# Altium schematic sheet Battery_and_Bypass_Controller_Connectons.SchDoc: Battery and Bypass Controller Connectons
size 292 x 193 mm; SheetNumber: 8; SheetTotal: 11; SPICEModelCacheMGYABEQD: <root> / <DocumentId>MGYABEQD</DocumentId> / </root>; SheetSize: A4
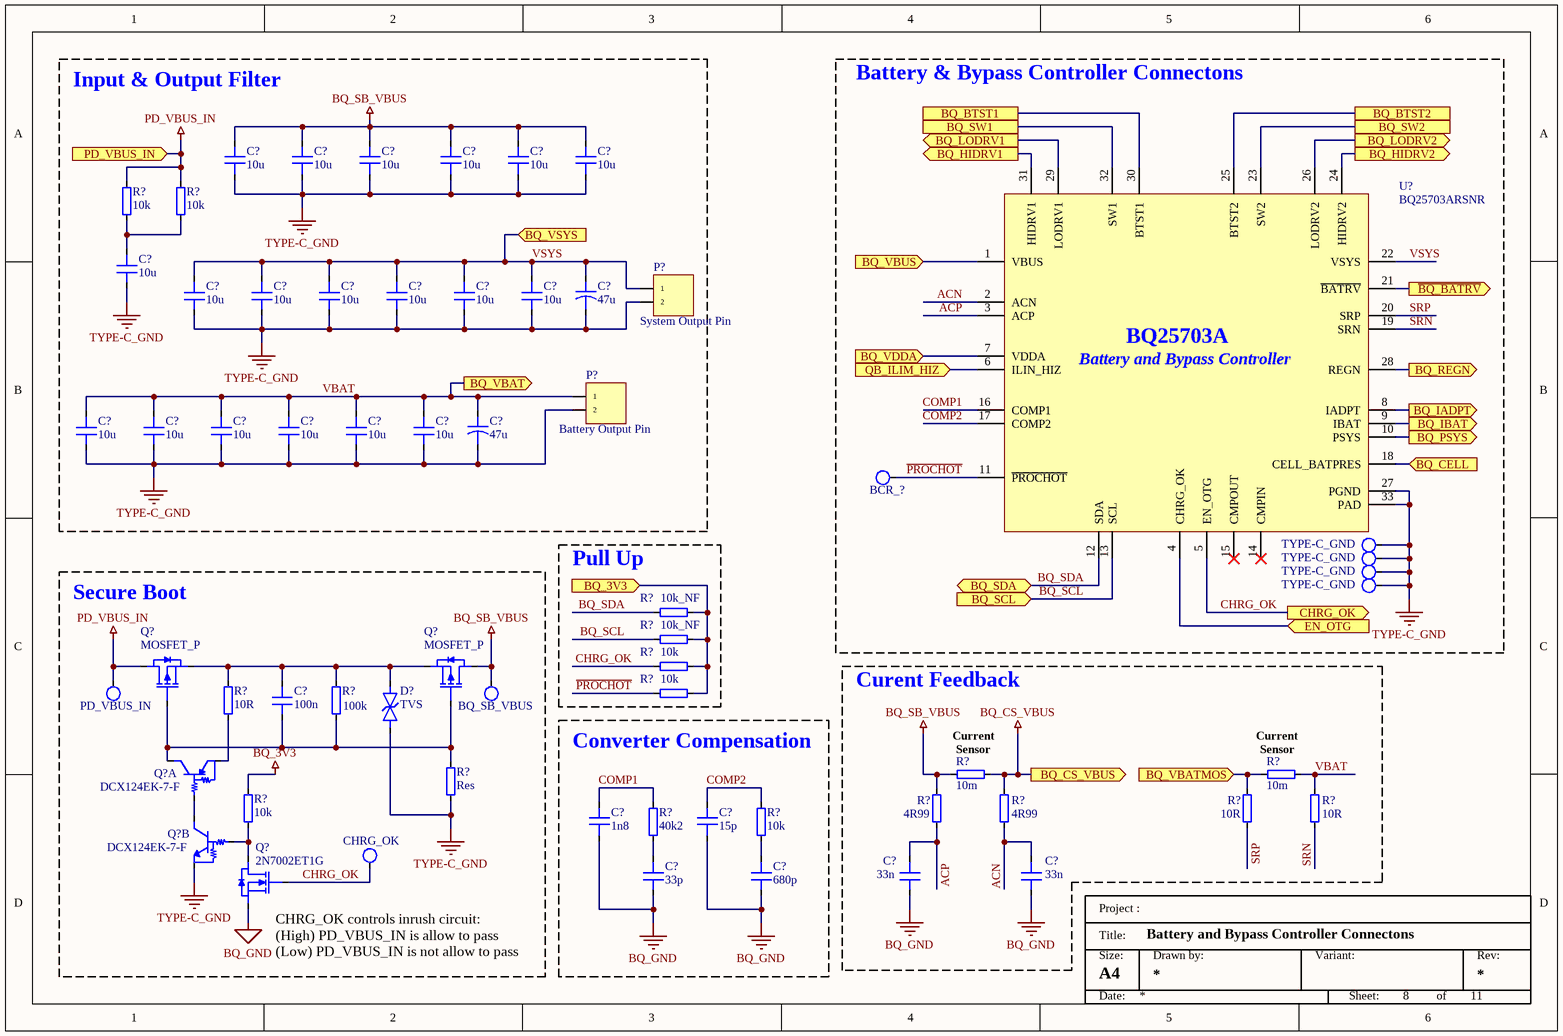
[diagram p0: Battery_and_Bypass_Controller_Connectons.SchDoc]

## Parts
(Parts that share a designator on the sheet are numbered #1, #2 ... from top to bottom, then left to right.)
BCR_?  SMD_25mil  [TestPoint_smd_25mil]  (value not drawn)
BQ_SB_VBUS  SMD_25mil  [TestPoint_smd_25mil]  (value not drawn)
C?#1  10u  [0805_Cap]
C?#2  10u  [0805_Cap]
C?#3  10u  [0805_Cap]
C?#4  10u  [0805_Cap]
C?#5  10u  [0805_Cap]
C?#6  10u  [0805_Cap]
C?#7  47u
C?#8  10u  [0805_Cap]
C?#9  10u  [0805_Cap]
C?#10  10u  [0805_Cap]
C?#11  10u  [0805_Cap]
C?#12  10u  [0805_Cap]
C?#13  10u  [0805_Cap]
C?#14  10u  [0805_Cap]
C?#15  47u
C?#16  10u  [0805_Cap]
C?#17  10u  [0805_Cap]
C?#18  10u  [0805_Cap]
C?#19  10u  [0805_Cap]
C?#20  10u  [0805_Cap]
C?#21  10u  [0805_Cap]
C?#22  100n  [0805_Cap]
C?#23  1n8  [0805_Cap]
C?#24  15p  [0805_Cap]
C?#25  33p  [0805_Cap]
C?#26  680p  [0805_Cap]
C?#27  33n  [0805_Cap]
C?#28  33n  [0805_Cap]
CHRG_OK  SMD_25mil  [TestPoint_smd_25mil]  (value not drawn)
D?  TVS  [SOD-523]
P?#1  System Output Pin  [XT60PW-M]
P?#2  Battery Output Pin  [XT60PW-M]
PD_VBUS_IN  SMD_25mil  [TestPoint_smd_25mil]  (value not drawn)
Q?#1  MOSFET_P  [SOT-523-3]
Q?#2  MOSFET_P  [SOT-523-3]
Q?#3  DCX124EK-7-F  [SOT-26]  (part A of 2)
Q?#4  2N7002ET1G  [SOT-523-3]
Q?#5  DCX124EK-7-F  [SOT-26]  (part B of 2)
R?#1  10k  [0603_Res]
R?#2  10k  [0603_Res]
R?#3  10k_NF  [0603_Res]
R?#4  10k_NF  [0603_Res]
R?#5  10k  [0603_Res]
R?#6  10R  [0603_Res]
R?#7  100k  [0603_Res]
R?#8  10k  [0603_Res]
R?#9  Res  [0603_Res]
R?#10  10m  [0603_Res]
R?#11  10m  [0603_Res]
R?#12  10k  [0603_Res]
R?#13  4R99  [0603_Res]
R?#14  4R99  [0603_Res]
R?#15  10R  [0603_Res]
R?#16  10R  [0603_Res]
R?#17  40k2  [0603_Res]
R?#18  10k  [0603_Res]
TYPE-C_GND#1  SMD_25mil  [TestPoint_smd_25mil]  (value not drawn)
TYPE-C_GND#2  SMD_25mil  [TestPoint_smd_25mil]  (value not drawn)
TYPE-C_GND#3  SMD_25mil  [TestPoint_smd_25mil]  (value not drawn)
TYPE-C_GND#4  SMD_25mil  [TestPoint_smd_25mil]  (value not drawn)
U?  BQ25703ARSNR  [WQFN-32]

## Blocks framed on the sheet
Input & Output Filter: C?#1-C?#21 P?#1 P?#2 R?#1 R?#2
Battery & Bypass Controller Connectons: BCR_? TYPE-C_GND#1-TYPE-C_GND#4 U?
Pull Up: R?#3-R?#5 R?#8
Secure Boot: BQ_SB_VBUS C?#22 CHRG_OK D? PD_VBUS_IN Q?#1-Q?#5 R?#6 R?#7 R?#9 R?#12
Curent Feedback: C?#27 C?#28 R?#10 R?#11 R?#13-R?#16
Converter Compensation: C?#23-C?#26 R?#17 R?#18

## Ports
BQ_3V3 (in), BQ_BTST1, BQ_BTST2, BQ_CELL (in), BQ_CS_VBUS (out), BQ_HIDRV1 (out), BQ_HIDRV2 (out), BQ_IADPT (out), BQ_IBAT (out), BQ_LODRV1 (out), BQ_LODRV2 (out), BQ_PSYS (out), BQ_REGN (out), BQ_SCL (in), BQ_SDA (bidir), BQ_SW1, BQ_SW2, BQ_VBAT (out), BQ_VBATMOS (in), BQ_VBUS (in), BQ_VDDA (in), BQ_VSYS (in), CHRG_OK (out), EN_OTG (in), PD_VBUS_IN (in), QB_ILIM_HIZ (in), ~{BQ_BATRV} (out)

## Nets
BQ_3V3: R?#12.1
BQ_CS_VBUS: R?#10.2 R?#14.1 ; port BQ_CS_VBUS
BQ_GND: C?#23.2 C?#24.2 C?#25.1 C?#26.1 C?#27.1 C?#28.1 Q?#4.3(S)
BQ_SB_VBUS: BQ_SB_VBUS.1 C?#1.1 C?#2.1 C?#3.1 C?#4.1 C?#5.1 C?#6.1 Q?#2.1(D1) R?#10.1 R?#13.1
PD_VBUS_IN: PD_VBUS_IN.1 Q?#1.1(D1) R?#1.2 R?#2.2 ; port PD_VBUS_IN
TYPE-C_GND: C?#1.2 C?#2.2 C?#3.2 C?#4.2 C?#5.2 C?#6.2 C?#7.2 C?#8.1 C?#9.1 C?#10.1 C?#11.1 C?#12.1 C?#13.1 C?#14.1 C?#15.2 C?#16.1 C?#17.1 C?#18.1 C?#19.1 C?#20.1 C?#21.1 D?.2(K) P?#1.2 P?#2.2 Q?#5.6(E2) R?#9.2 TYPE-C_GND#1.1 TYPE-C_GND#2.1 TYPE-C_GND#3.1 TYPE-C_GND#4.1 U?.27(PGND) U?.33(PAD)
~{BQ_BATRV}: U?.21(~{BATRV}) ; port ~{BQ_BATRV}
~{PROCHOT}: BCR_?.1 R?#8.2 U?.11(~{PROCHOT})
ACN: C?#28.2 R?#14.2 U?.2(ACN)
ACP: C?#27.2 R?#13.2 U?.3(ACP)
BQ_3V3: R?#3.2 R?#4.1 R?#5.1 R?#8.1 ; port BQ_3V3  [a separate net that carries the same name]
BQ_BTST1: U?.30(BTST1) ; port BQ_BTST1
BQ_BTST2: U?.25(BTST2) ; port BQ_BTST2
BQ_CELL: U?.18(CELL_BATPRES) ; port BQ_CELL
BQ_HIDRV1: U?.31(HIDRV1) ; port BQ_HIDRV1
BQ_HIDRV2: U?.24(HIDRV2) ; port BQ_HIDRV2
BQ_IADPT: U?.8(IADPT) ; port BQ_IADPT
BQ_IBAT: U?.9(IBAT) ; port BQ_IBAT
BQ_LODRV1: U?.29(LODRV1) ; port BQ_LODRV1
BQ_LODRV2: U?.26(LODRV2) ; port BQ_LODRV2
BQ_PSYS: U?.10(PSYS) ; port BQ_PSYS
BQ_REGN: U?.28(REGN) ; port BQ_REGN
BQ_SCL: R?#4.2 U?.13(SCL) ; port BQ_SCL
BQ_SDA: R?#3.1 U?.12(SDA) ; port BQ_SDA
BQ_SW1: U?.32(SW1) ; port BQ_SW1
BQ_SW2: U?.23(SW2) ; port BQ_SW2
BQ_VBATMOS: R?#11.1 R?#15.1 ; port BQ_VBATMOS
BQ_VBUS: U?.1(VBUS) ; port BQ_VBUS
BQ_VDDA: U?.7(VDDA) ; port BQ_VDDA
CHRG_OK: CHRG_OK.1 Q?#4.2(G) R?#5.2 U?.5(EN_OTG) ; port CHRG_OK
COMP1: C?#23.1 R?#17.2 U?.16(COMP1)
COMP2: C?#24.1 R?#18.2 U?.17(COMP2)
EN_OTG: U?.4(CHRG_OK) ; port EN_OTG
QB_ILIM_HIZ: U?.6(ILIN_HIZ) ; port QB_ILIM_HIZ
SRN: R?#16.2 U?.19(SRN)
SRP: R?#15.2 U?.20(SRP)
VBAT: C?#15.1 C?#16.2 C?#17.2 C?#18.2 C?#19.2 C?#20.2 C?#21.2 P?#2.1 R?#11.2 R?#16.1 ; port BQ_VBAT
VSYS: C?#7.1 C?#9.2 C?#10.2 C?#11.2 C?#12.2 C?#13.2 C?#14.2 P?#1.1 U?.22(VSYS) ; port BQ_VSYS
NetC?#8_2: C?#8.2 R?#1.1 R?#2.1
NetC?#22_1: C?#22.1 Q?#1.2(G1) Q?#2.2(G1) Q?#3.4(C1) R?#7.2 R?#9.1
NetC?#22_2: C?#22.2 D?.1(A) Q?#1.3(S1) Q?#2.3(S1) R?#6.1 R?#7.1
NetC?#25_2: C?#25.2 R?#17.1
NetC?#26_2: C?#26.2 R?#18.1
NetQ?#3_1: Q?#3.1(E1) R?#6.2
NetQ?#3_2: Q?#3.2(B1) Q?#5.3(C2)
NetQ?#4_1: Q?#4.1(D) Q?#5.5(B2) R?#12.2

Not connected (* = marked no-connect by the designer): U? 14(CMPIN)* 15(CMPOUT)*

## Notes on the sheet
- (near R?#10) Current
  Sensor
- (near R?#11) Current
  Sensor
- (near Q?#4) CHRG_OK controls inrush circuit:
  (High) PD_VBUS_IN is allow to pass
  (Low) PD_VBUS_IN is not allow to pass
- Project :
- Size:
- Title:
- Drawn by:
- Variant:
- Rev:
- Date:
- Sheet:
- of
- (in symbol BQ25703ARSNR) BQ25703A; Battery and Bypass Controller

## Library data of the parts
BCR_? BQ_SB_VBUS CHRG_OK PD_VBUS_IN TYPE-C_GND#1-TYPE-C_GND#4 = Test_Point: General test point; Mfr. #: N/A; Mfr.: N/A; Distributor_Link: N/A; Datasheet: N/A; Distributor #: N/A
C?#1-C?#6 C?#8-C?#14 C?#16-C?#28 = Cap: General capacitor (non-polarized); Mfr. #: *; Mfr.: *; Distributor_Link: *; Datasheet: *; Distributor #: *
C?#7 C?#15 = Cap_2: General capacitor (with polarity); Mfr. #: *; Mfr.: *; Distributor_Link: *; Datasheet: *; Distributor #: *
D? = TVS: General TVS; Mfr. #: *; Mfr.: *; Distributor_Link: *; Datasheet: *; Distributor #: *
P?#1 = Header_2x1: Battery Output Pin; Mfr. #: *; Mfr.: *; Distributor_Link: *; Datasheet: *; Distributor #: *
P?#2 = Header_2x1: Mfr. #: *; Mfr.: *; Distributor_Link: *; Datasheet: *; Distributor #: *
Q?#1 Q?#2 = MOSFET_P: General p channel mosfet; Mfr. #: *; Mfr.: *; Distributor_Link: *; Datasheet: *; Distributor #: *
Q?#3 Q?#5 = DCX124EK-7-F: Bipolar Transistors - Pre-Biased PREBIASED TRANSISTOR SOT-26 300MW; Mfr.: Diodes Incorporated; Mfr. #: DCX124EK-7-F; Distributor_Link: https://www.mouser.tw/ProductDetail/Diodes-Incorporated/DCX124EK-7-F?qs=oVWkMaT70e5dmImuN6ueZA%3D%3D; Datasheet: https://www.diodes.com/assets/Datasheets/ds30350.pdf; Distributor #: 621-DCX124EK-7-F
Q?#4 = MOSFET_N: General n channel mosfet; Mfr. #: *; Mfr.: *; Distributor_Link: *; Datasheet: *; Distributor #: *
R?#1-R?#18 = Res: General Resistor; Mfr. #: *; Mfr.: *; Distributor_Link: *; Datasheet: *; Distributor #: *
U? = BQ25703ARSNR: Battery Management I2C 1-4 cell NVDC Buck-Boost battery charge controller with system power monitor & processor 32-QFN -40 to 85; Mfr.: Texas Instruments; Distributor_Link: https://www.mouser.tw/ProductDetail/Texas-Instruments/BQ25703ARSNR?qs=5aG0NVq1C4wREUY%2F32PenQ%3D%3D; Mfr. #: BQ25703ARSNR; Datasheet: https://www.ti.com/general/docs/suppproductinfo.tsp?distId=26&gotoUrl=https://www.ti.com/lit/gpn/bq25703a; Distributor #: 595-BQ25703ARSNR